# EAGLE design elm104 (EAGLE 4.16)

## Sheet 1 of 3
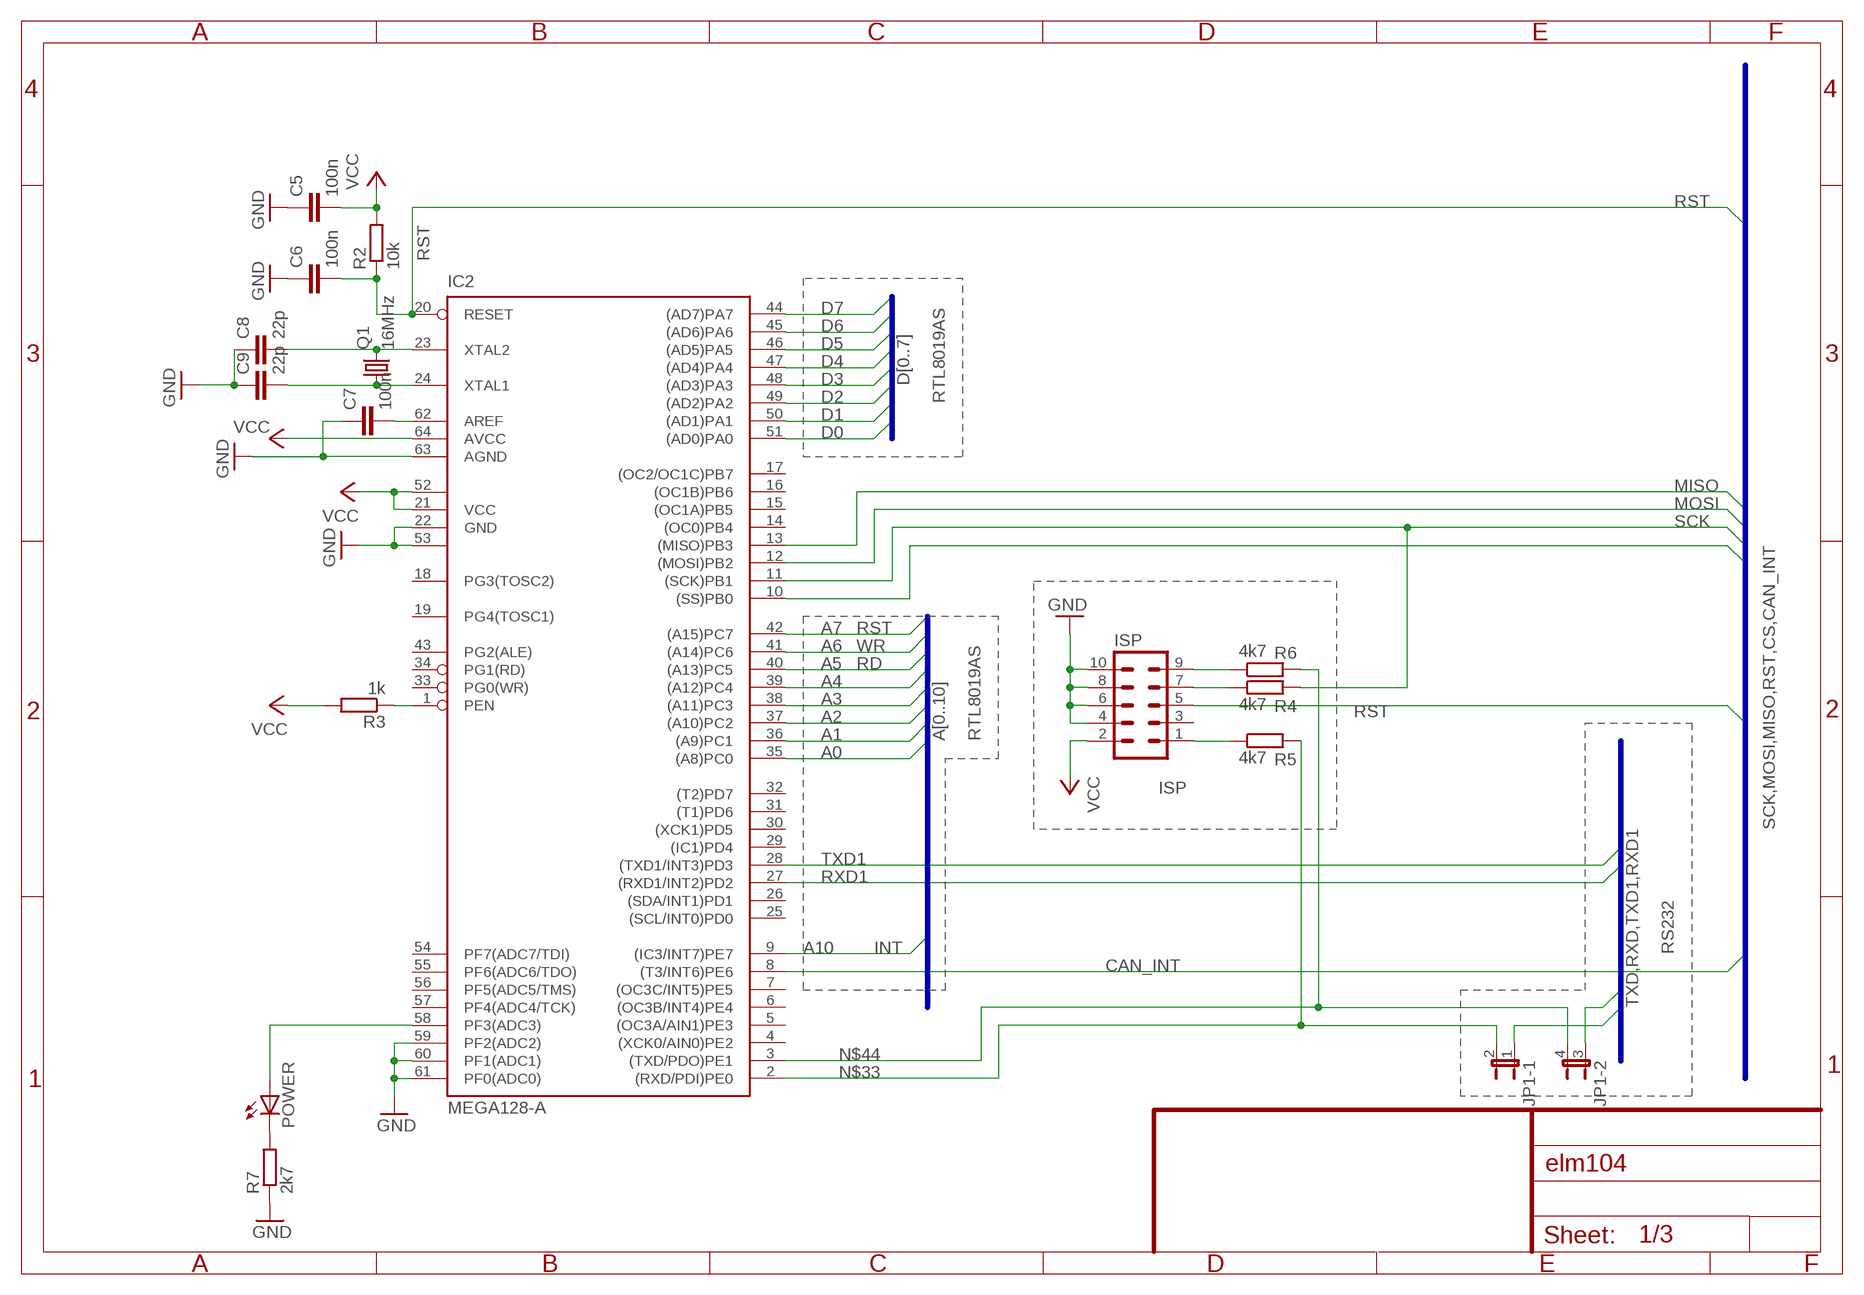
[diagram p0: schematic, sheet 1]

### Parts
C5  100n  C-EUC0603  [C0603]
C6  100n  C-EUC0603  [C0603]
C7  100n  C-EUC0603  [C0603]
C8  22p  C-EUC0603  [C0603]
C9  22p  C-EUC0603  [C0603]
IC2  MEGA128-A  [TQFP64]
ISP  MA05-2  [MA05-2]
JP1  JP2QE  [JP2Q]
POWER  LEDCHIP-LED0805  [CHIP-LED0805]
Q1  16MHz  CRYSTALHC49U-V  [HC49U-V]
R2  10k  R-EU_R0805  [R0805]
R3  1k  R-EU_R0805  [R0805]
R4  4k7  R-EU_R0805  [R0805]
R5  4k7  R-EU_R0805  [R0805]
R6  4k7  R-EU_R0805  [R0805]
R7  2k7  R-EU_R0805  [R0805]

### Nets
A0: IC2.35((A8)PC0) ; also sheet 3
A1: IC2.36((A9)PC1) ; also sheet 3
A2: IC2.37((A10)PC2) ; also sheet 3
A3: IC2.38((A11)PC3) ; also sheet 3
A4: IC2.39((A12)PC4) ; also sheet 3
A5: IC2.40((A13)PC5) ; also sheet 3
A6: IC2.41((A14)PC6) ; also sheet 3
A7: IC2.42((A15)PC7) ; also sheet 3
A10: IC2.9((IC3/INT7)PE7) ; also sheet 3
CAN_INT: IC2.8((T3/INT6)PE6) ; also sheet 2
CS: IC2.10((SS)PB0) ; also sheet 2
D0: IC2.51((AD0)PA0) ; also sheet 3
D1: IC2.50((AD1)PA1) ; also sheet 3
D2: IC2.49((AD2)PA2) ; also sheet 3
D3: IC2.48((AD3)PA3) ; also sheet 3
D4: IC2.47((AD4)PA4) ; also sheet 3
D5: IC2.46((AD5)PA5) ; also sheet 3
D6: IC2.45((AD6)PA6) ; also sheet 3
D7: IC2.44((AD7)PA7) ; also sheet 3
GND: C5.1 C6.1 C7.1 C8.1 C9.1 IC2.22(GND) IC2.53(GND1) IC2.59(PF2(ADC2)) IC2.60(PF1(ADC1)) IC2.61(PF0(ADC0)) IC2.63(AGND) ISP.4 ISP.6 ISP.8 ISP.10 R7.1 ; also sheet 2,3
MISO: IC2.13((MISO)PB3) ; also sheet 2
MOSI: IC2.12((MOSI)PB2) ; also sheet 2
N$5: C7.2 IC2.62(AREF)
N$6: C9.2 IC2.24(XTAL1) Q1.1
N$7: C8.2 IC2.23(XTAL2) Q1.2
N$9: POWER.C R7.2
N$22: ISP.9 R6.1
N$25: ISP.1 R5.1
N$26: IC2.1(PEN) R3.1
N$29: ISP.7 R4.1
N$32: IC2.58(PF3(ADC3)) POWER.A
N$33: IC2.2((RXD/PDI)PE0) JP1.2 R5.2
N$44: IC2.3((TXD/PDO)PE1) JP1.4 R6.2
RST: C6.2 IC2.20(RESET) ISP.5 R2.1 ; also sheet 2
RXD: JP1.1 ; also sheet 2
RXD1: IC2.27((RXD1/INT2)PD2) ; also sheet 2
SCK: IC2.11((SCK)PB1) R4.2 ; also sheet 2
TXD: JP1.3 ; also sheet 2
TXD1: IC2.28((TXD1/INT3)PD3) ; also sheet 2
VCC: C5.2 IC2.21(VCC) IC2.52(VCC1) IC2.64(AVCC) ISP.2 R2.2 R3.2 ; also sheet 2,3
Unconnected: IC2.4((XCK0/AIN0)PE2) IC2.5((OC3A/AIN1)PE3) IC2.6((OC3B/INT4)PE4) IC2.7((OC3C/INT5)PE5) IC2.14((OC0)PB4) IC2.15((OC1A)PB5) IC2.16((OC1B)PB6) IC2.17((OC2/OC1C)PB7) IC2.18(PG3(TOSC2)) IC2.19(PG4(TOSC1)) IC2.25((SCL/INT0)PD0) IC2.26((SDA/INT1)PD1) IC2.29((IC1)PD4) IC2.30((XCK1)PD5) IC2.31((T1)PD6) IC2.32((T2)PD7) IC2.33(PG0(WR)) IC2.34(PG1(RD)) IC2.43(PG2(ALE)) IC2.54(PF7(ADC7/TDI)) IC2.55(PF6(ADC6/TDO)) IC2.56(PF5(ADC5/TMS)) IC2.57(PF4(ADC4/TCK)) ISP.3

### Buses
SCK,MOSI,MISO,RST,CS,CAN_INT
TXD,RXD,TXD1,RXD1
D[0..7]
A[0..10]

### Notes on the sheet
- RTL8019AS
- RST
- WR
- RD
- RTL8019AS
- ISP
- INT | RS232

## Sheet 2 of 3
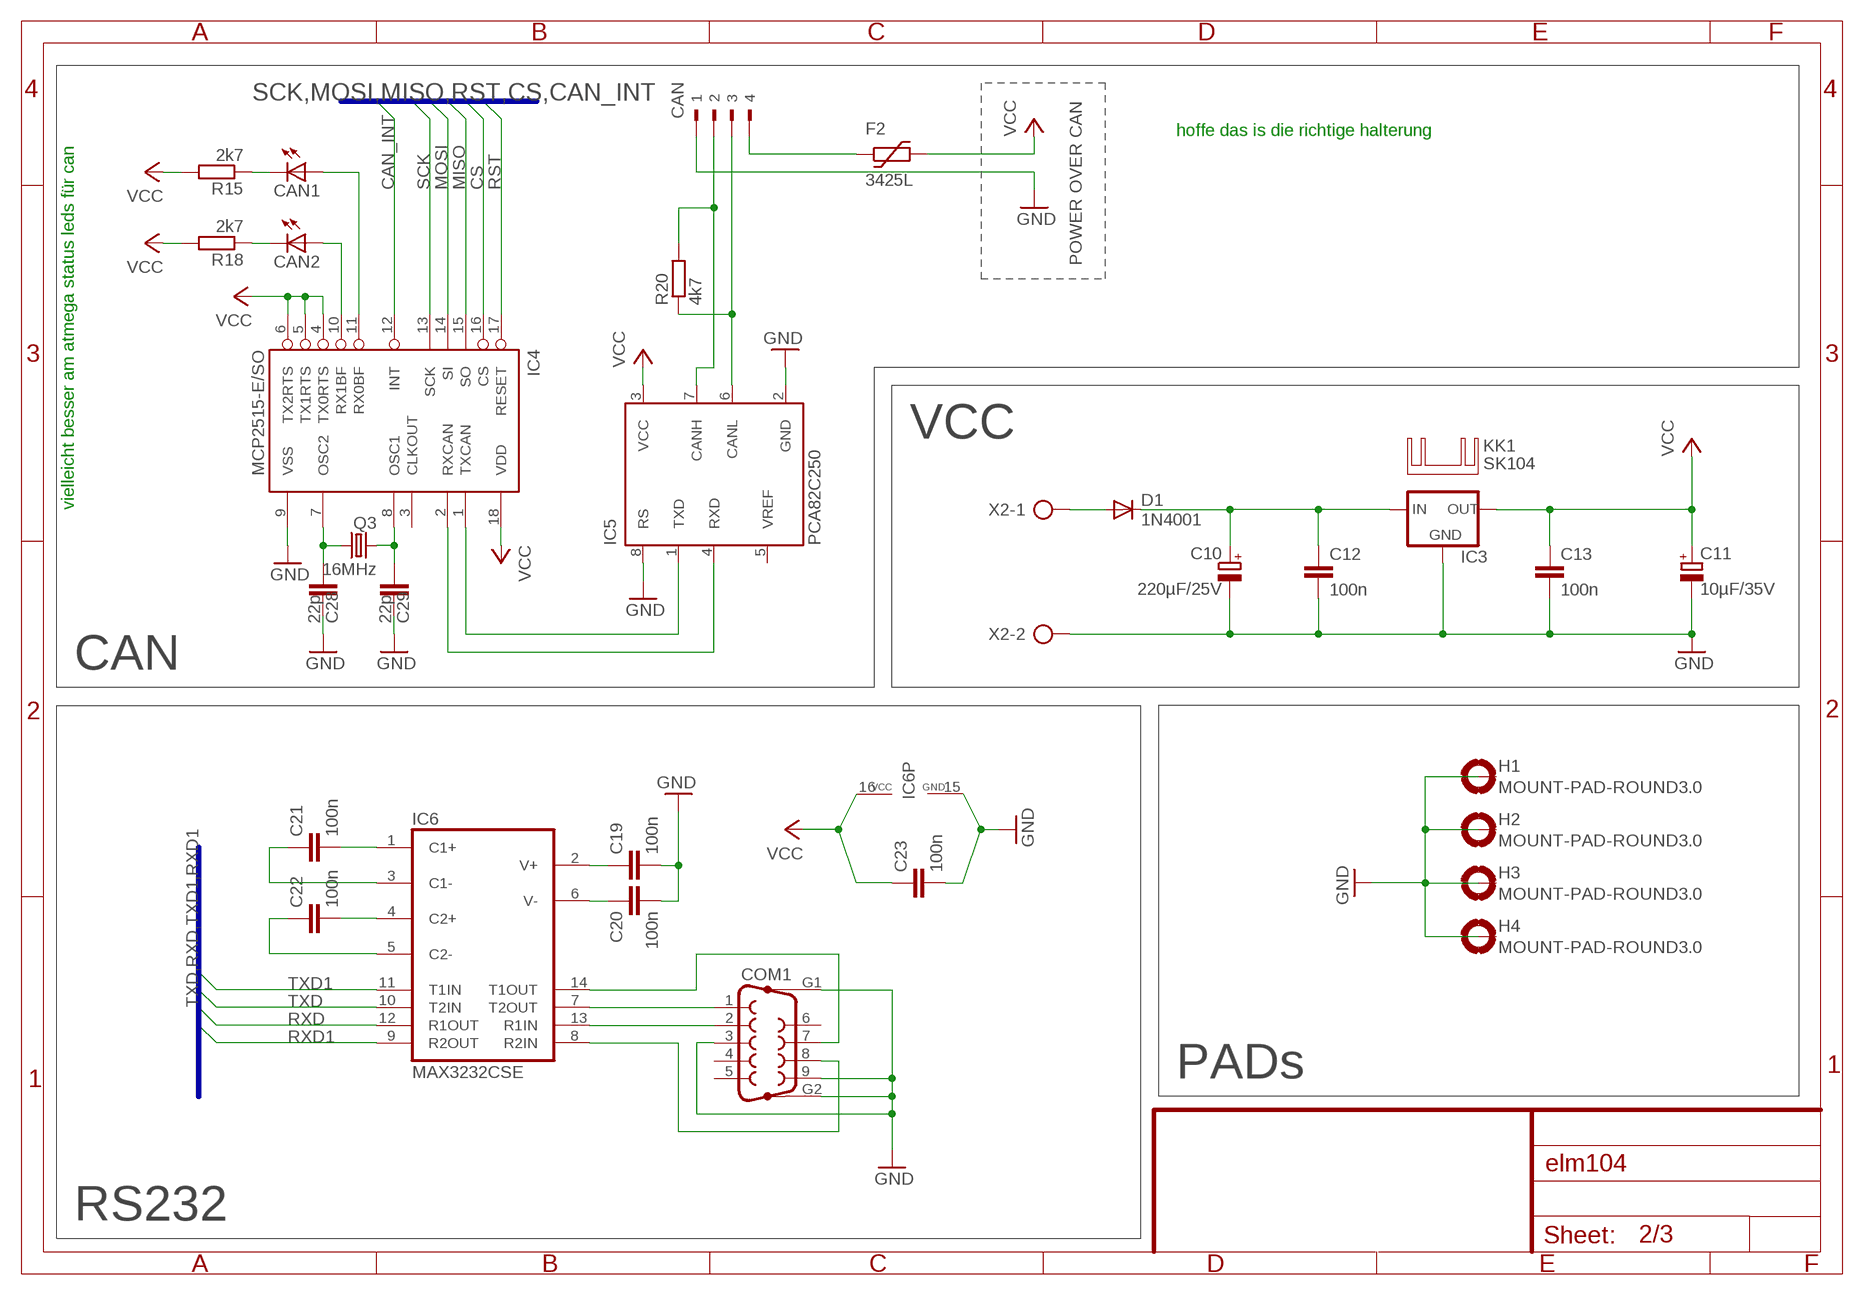
[diagram p1: schematic, sheet 2]

### Parts
C10  220µF/25V  CPOL-EUE3.5-8  [E3,5-8]
C11  10µF/35V  CPOL-EUE2-5  [E2-5]
C12  100n  C-EUC0603  [C0603]
C13  100n  C-EUC0603  [C0603]
C19  100n  C-EUC0603  [C0603]
C20  100n  C-EUC0603  [C0603]
C21  100n  C-EUC0603  [C0603]
C22  100n  C-EUC0603  [C0603]
C23  100n  C-EUC0603  [C0603]
C28  22p  C-EUC0603  [C0603]
C29  22p  C-EUC0603  [C0603]
CAN  90-4  [90-4]
CAN1  LEDCHIP-LED0805  [CHIP-LED0805]
CAN2  LEDCHIP-LED0805  [CHIP-LED0805]
COM1  F09HP  [F09HP]
D1  1N4001  DIODE-DO41-10  [DO41-10]
F2  3425L  [3425L]
H1  MOUNT-PAD-ROUND3.0  [3,0-PAD]
H2  MOUNT-PAD-ROUND3.0  [3,0-PAD]
H3  MOUNT-PAD-ROUND3.0  [3,0-PAD]
H4  MOUNT-PAD-ROUND3.0  [3,0-PAD]
IC3  78XXS  [78XXS]
IC4  MCP2515-E/SO  [SO18L]
IC5  PCA82C250  [DIL08]
IC6  MAX3232CSE  [SO16]
KK1  SK104  [SK104]
Q3  16MHz  CRYSTALHC49U-V  [HC49U-V]
R15  2k7  R-EU_R0805  [R0805]
R18  2k7  R-EU_R0805  [R0805]
R20  4k7  R-EU_R0805  [R0805]
X2  AK500/2-H  [AK500/2-H]

### Nets
CAN_INT: IC4.12(INT) ; also sheet 1
CS: IC4.16(CS) ; also sheet 1
GND: C10.- C11.- C12.2 C13.2 C19.2 C20.2 C23.2 C28.2 C29.2 CAN.1 COM1.3 COM1.9 COM1.G1 COM1.G2 H1.B3,0(MOUNT) H2.B3,0(MOUNT) H3.B3,0(MOUNT) H4.B3,0(MOUNT) IC3.GND IC4.9(VSS) IC5.2(GND) IC5.8(RS) IC6.15(GND) X2.2 ; also sheet 1,3
MISO: IC4.15(SO) ; also sheet 1
MOSI: IC4.14(SI) ; also sheet 1
N$2: IC4.1(TXCAN) IC5.1(TXD)
N$8: C10.+ C12.1 D1.C IC3.IN
N$10: D1.A X2.1
N$16: CAN.4 F2.P$1
N$17: C21.2 IC6.1(C1+)
N$21: IC4.2(RXCAN) IC5.4(RXD)
N$23: CAN.3 IC5.6(CANL) R20.1
N$27: CAN1.A IC4.11(RX0BF)
N$30: C22.2 IC6.4(C2+)
N$36: C22.1 IC6.5(C2-)
N$37: C21.1 IC6.3(C1-)
N$38: CAN2.A IC4.10(RX1BF)
N$40: COM1.7 IC6.14(T1OUT)
N$41: COM1.8 IC6.8(R2IN)
N$43: C19.1 IC6.2(V+)
N$46: C20.1 IC6.6(V-)
N$48: CAN1.C R15.1
N$49: COM1.1 IC6.7(T2OUT)
N$50: COM1.2 IC6.13(R1IN)
N$52: CAN2.C R18.1
N$53: C28.1 IC4.7(OSC2) Q3.1
N$54: C29.1 IC4.8(OSC1) Q3.2
N$59: CAN.2 IC5.7(CANH) R20.2
RST: IC4.17(RESET) ; also sheet 1
RXD: IC6.12(R1OUT) ; also sheet 1
RXD1: IC6.9(R2OUT) ; also sheet 1
SCK: IC4.13(SCK) ; also sheet 1
TXD: IC6.10(T2IN) ; also sheet 1
TXD1: IC6.11(T1IN) ; also sheet 1
VCC: C11.+ C13.1 C23.1 F2.P$2 IC3.OUT IC4.4(TX0RTS) IC4.5(TX1RTS) IC4.6(TX2RTS) IC4.18(VDD) IC5.3(VCC) IC6.16(VCC) R15.2 R18.2 ; also sheet 1,3
Unconnected: COM1.4 COM1.5 COM1.6 IC4.3(CLKOUT) IC5.5(VREF)

### Buses
SCK,MOSI,MISO,RST,CS,CAN_INT
TXD,RXD,TXD1,RXD1

### Notes on the sheet
- POWER OVER CAN
- hoffe das is die richtige halterung
- VCC
- vielleicht besser am atmega status leds für can
- CAN
- PADs
- RS232

## Sheet 3 of 3
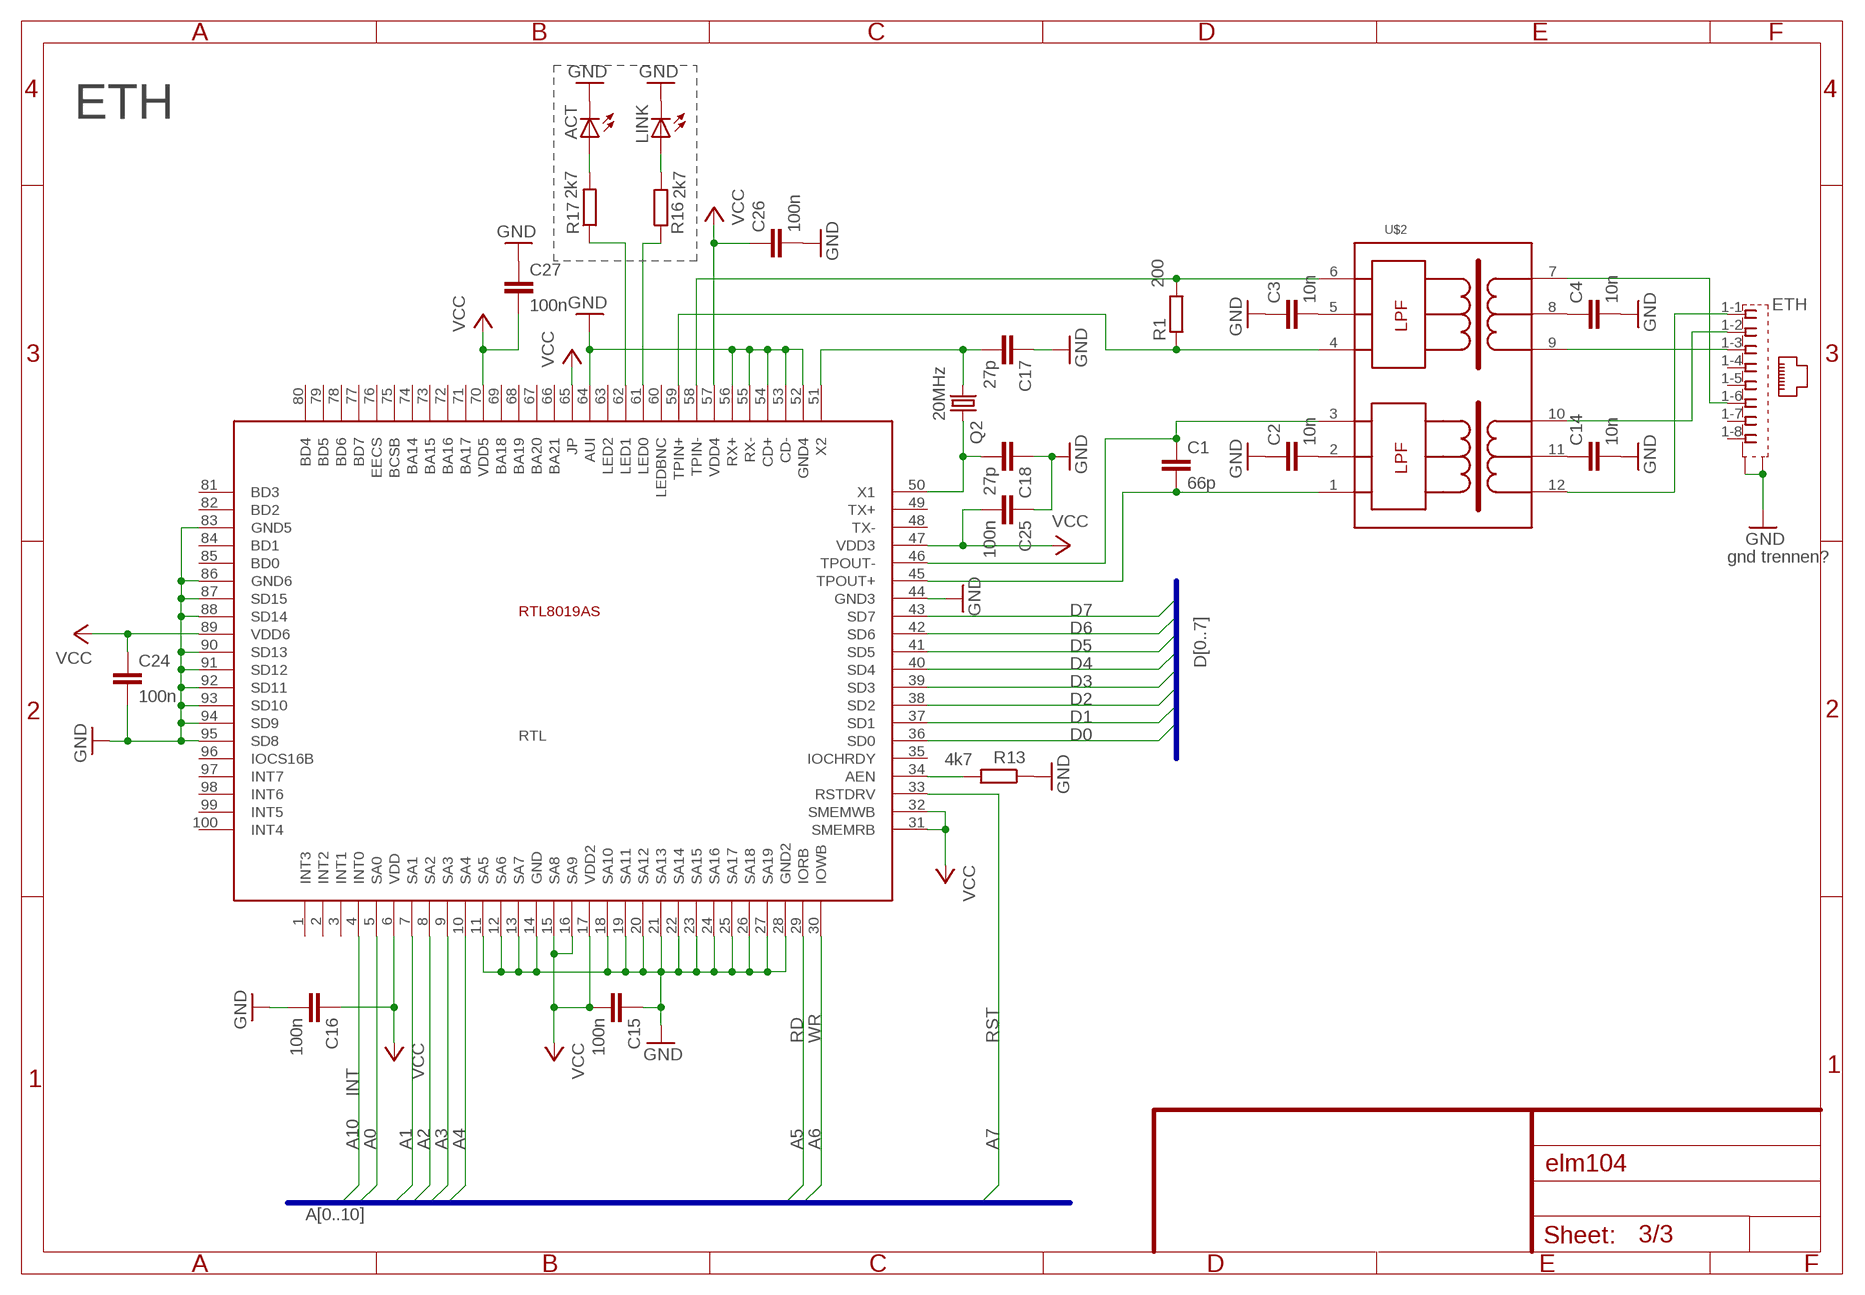
[diagram p2: schematic, sheet 3]

### Parts
ACT  LEDCHIP-LED0805  [CHIP-LED0805]
C1  66p  C-EUC0603  [C0603]
C2  10n  C-EUC0603  [C0603]
C3  10n  C-EUC0603  [C0603]
C4  10n  C-EUC0603  [C0603]
C14  10n  C-EUC0603  [C0603]
C15  100n  C-EUC0603  [C0603]
C16  100n  C-EUC0603  [C0603]
C17  27p  C-EUC0603  [C0603]
C18  27p  C-EUC0603  [C0603]
C24  100n  C-EUC0603  [C0603]
C25  100n  C-EUC0603  [C0603]
C26  100n  C-EUC0603  [C0603]
C27  100n  C-EUC0603  [C0603]
ETH  557786-1  [557786-1]
LINK  LEDCHIP-LED0805  [CHIP-LED0805]
Q2  20MHz  CRYSTALHC49U-V  [HC49U-V]
R1  200  R-EU_R0805  [R0805]
R13  4k7  R-EU_R0805  [R0805]
R16  2k7  R-EU_R0805  [R0805]
R17  2k7  R-EU_R0805  [R0805]
RTL  RTL8019AS  [RTL8019AS]
U$2  20F001  [DIL16/12]

### Nets
A0: RTL.5(SA0) ; also sheet 1
A1: RTL.7(SA1) ; also sheet 1
A2: RTL.8(SA2) ; also sheet 1
A3: RTL.9(SA3) ; also sheet 1
A4: RTL.10(SA4) ; also sheet 1
A5: RTL.29(IORB) ; also sheet 1
A6: RTL.30(IOWB) ; also sheet 1
A7: RTL.33(RSTDRV) ; also sheet 1
A10: RTL.4(INT0) ; also sheet 1
D0: RTL.36(SD0) ; also sheet 1
D1: RTL.37(SD1) ; also sheet 1
D2: RTL.38(SD2) ; also sheet 1
D3: RTL.39(SD3) ; also sheet 1
D4: RTL.40(SD4) ; also sheet 1
D5: RTL.41(SD5) ; also sheet 1
D6: RTL.42(SD6) ; also sheet 1
D7: RTL.43(SD7) ; also sheet 1
GND: ACT.C C2.1 C3.1 C4.2 C14.2 C15.1 C16.2 C17.1 C18.1 C24.2 C25.1 C26.2 C27.1 ETH.G1(S2) ETH.G2(S1) LINK.C R13.1 RTL.11(SA5) RTL.12(SA6) RTL.13(SA7) RTL.14(GND) RTL.18(SA10) RTL.19(SA11) RTL.20(SA12) RTL.21(SA13) RTL.22(SA14) RTL.23(SA15) RTL.24(SA16) RTL.25(SA17) RTL.26(SA18) RTL.27(SA19) RTL.28(GND2) RTL.44(GND3) RTL.52(GND4) RTL.53(CD-) RTL.54(CD+) RTL.55(RX-) RTL.56(RX+) RTL.64(AUI) RTL.83(GND5) RTL.86(GND6) RTL.87(SD15) RTL.88(SD14) RTL.90(SD13) RTL.91(SD12) RTL.92(SD11) RTL.93(SD10) RTL.94(SD9) RTL.95(SD8) ; also sheet 1,2
N$1: R1.2 RTL.58(TPIN-) U$2.6
N$3: R1.1 RTL.59(TPIN+) U$2.4
N$4: C1.1 RTL.46(TPOUT-) U$2.3
N$11: C1.2 RTL.45(TPOUT+) U$2.1
N$12: C3.2 U$2.5
N$13: C2.2 U$2.2
N$14: C14.1 U$2.11
N$15: C4.1 U$2.8
N$18: ETH.1-1 U$2.12
N$19: ETH.1-2 U$2.10
N$20: ETH.1-3 U$2.9
N$24: ETH.1-6 U$2.7
N$28: ACT.A R17.2
N$31: LINK.A R16.2
N$34: C17.2 Q2.2 RTL.51(X2)
N$35: C18.2 Q2.1 RTL.50(X1)
N$39: R13.2 RTL.34(AEN)
N$45: R16.1 RTL.61(LED0)
N$47: R17.1 RTL.62(LED1)
VCC: C15.2 C16.1 C24.1 C25.2 C26.1 C27.2 RTL.6(VDD) RTL.15(SA8) RTL.16(SA9) RTL.17(VDD2) RTL.31(SMEMRB) RTL.32(SMEMWB) RTL.47(VDD3) RTL.57(VDD4) RTL.65(JP) RTL.70(VDD5) RTL.89(VDD6) ; also sheet 1,2
Unconnected: ETH.1-4 ETH.1-5 ETH.1-7 ETH.1-8 RTL.1(INT3) RTL.2(INT2) RTL.3(INT1) RTL.35(IOCHRDY) RTL.48(TX-) RTL.49(TX+) RTL.60(LEDBNC) RTL.63(LED2) RTL.66(BA21) RTL.67(BA20) RTL.68(BA19) RTL.69(BA18) RTL.71(BA17) RTL.72(BA16) RTL.73(BA15) RTL.74(BA14) RTL.75(BCSB) RTL.76(EECS) RTL.77(BD7) RTL.78(BD6) RTL.79(BD5) RTL.80(BD4) RTL.81(BD3) RTL.82(BD2) RTL.84(BD1) RTL.85(BD0) RTL.96(IOCS16B) RTL.97(INT7) RTL.98(INT6) RTL.99(INT5) RTL.100(INT4)

### Buses
D[0..7]
A[0..10]

### Notes on the sheet
- ETH
- gnd trennen?
- RD | WR | RST
- INT

## Library data of the parts
ACT CAN1 CAN2 LINK POWER = led:LED: LED OSRAM: - CHIPLED LG R971, LG N971, LY N971, LG Q971, LY Q971, LO R971, LY R971 LH N974, LH R974 LS Q976, LO Q976, LY Q976 LO Q996 - Hyper CHIPLED LW Q18S LB Q993, LB Q99A, LB R99A - SideLED LS A670, LO A670, LY A670, LG A670, LP A670 LB A673, LV A673, LT A673, LW A673 LH A674 LY A675 LS A676, LA A676, LO A676, LY A676, LW A676 LS A679, LY A679, LG A679 - Hyper Micro SIDELED® LS Y876, LA Y876, LO Y876, LY Y876 LT Y87S - SmartLED LW L88C, LW L88S LB L89C, LB L89S, LG L890 LS L89K, LO L89K, LY L89K LS L896, LA L896, LO L896, LY L896 - TOPLED LS T670, LO T670, LY T670, LG T670, LP T670 LSG T670, LSP T670, LSY T670, LOP T670, LYG T670 LG T671, LOG T671, LSG T671 LB T673, LV T673, LT T673, LW T673 LH T674 LS T676, LA T676, LO T676, LY T676, LB T676, LH T676, LSB T676, LW T676 LB T67C, LV T67C, LT T67C, LS T67K, LO T67K, LY T67K, LW E67C LS E67B, LA E67B, LO E67B, LY E67B, LB E67C, LV E67C, LT E67C LW T67C LS T679, LY T679, LG T679 LS T770, LO T770, LY T770, LG T770, LP T770 LB T773, LV T773, LT T773, LW T773 LH T774 LS E675, LA E675, LY E675, LS T675 LS T776, LA T776, LO T776, LY T776, LB T776 LHGB T686 LT T68C, LB T68C - Hyper Mini TOPLED® LB M676 - Mini TOPLED Santana® LG M470 LS M47K, LO M47K, LY M47K Source: http://www.osram.convergy.de - LUMILED® LXK2-PW12-R00, LXK2-PW12-S00, LXK2-PW14-U00, LXK2-PW14-V00 LXK2-PM12-R00, LXK2-PM12-S00, LXK2-PM14-U00 LXK2-PE12-Q00, LXK2-PE12-R00, LXK2-PE12-S00, LXK2-PE14-T00, LXK2-PE14-U00 LXK2-PB12-K00, LXK2-PB12-L00, LXK2-PB12-M00, LXK2-PB14-N00, LXK2-PB14-P00, LXK2-PB14-Q00 LXK2-PR12-L00, LXK2-PR12-M00, LXK2-PR14-Q00, LXK2-PR14-R00 LXK2-PD12-Q00, LXK2-PD12-R00, LXK2-PD12-S00 LXK2-PH12-R00, LXK2-PH12-S00 LXK2-PL12-P00, LXK2-PL12-Q00, LXK2-PL12-R00 Source: www.luxeon.com
C1-C9 C12-C29 = rcl:C-EU: CAPACITOR, European symbol
C10 C11 = rcl:CPOL-EU: POLARIZED CAPACITOR, European symbol
CAN = con-weidmueller-sl35:90-4: WEIDMUELLER CLAMP CONNECTOR
COM1 = con-subd:F09HP: SUB-D
D1 = diode:DIODE-: DIODE
ETH = con-amp:557786-1: AMP connector
F2 = ptc-littlefuse:3425L
H1-H4 = holes:MOUNT-PAD-ROUND: MOUNTING PAD, round
IC2 = atmel:MEGA128: MICROCONTROLLER 128 Kbytes FLASH 4 Kbytes SRAM 4 Kbytes EEPROM DUAL USART 8-channel 10 bit ADC Source: avr.lbr
IC3 = v-reg:78XXS: VOLTAGE REGULATOR
IC4 = mcp2515:MCP2515
IC5 = micro-philips:PCA82C250: CAN CONTROLLER INTERFACE
IC6 = maxim:MAX3232*: True RS-232 Transceivers 3.0V to 5.5V, Low-Power up to 1Mbps, Using Four 0.1µF External Capacitors Source: http://pdfserv.maxim-ic.com/en/ds/MAX3222-MAX3241.pdf
ISP = con-lstb:MA05-2: PIN HEADER
JP1 = jumper:JP2QE: JUMPER
KK1 = heatsink:SK104: HEATSINK manufacturer Fischer/distributor Buerklin
Q1-Q3 = crystal:CRYSTAL: CRYSTAL
R1-R7 R13 R15-R18 R20 = rcl:R-EU_: RESISTOR, European symbol
RTL = rtl8019as:RTL8019AS
U$2 = Realtek:20F001
X2 = con-ptr500:AK500/2-H: CONNECTOR Aug. 2004 / PTR Meßtechnik: Die Bezeichnung der Serie AK505 wurde geändert. Es handelt sich hierbei um AK500 in horizontaler Ausführung.

## Board
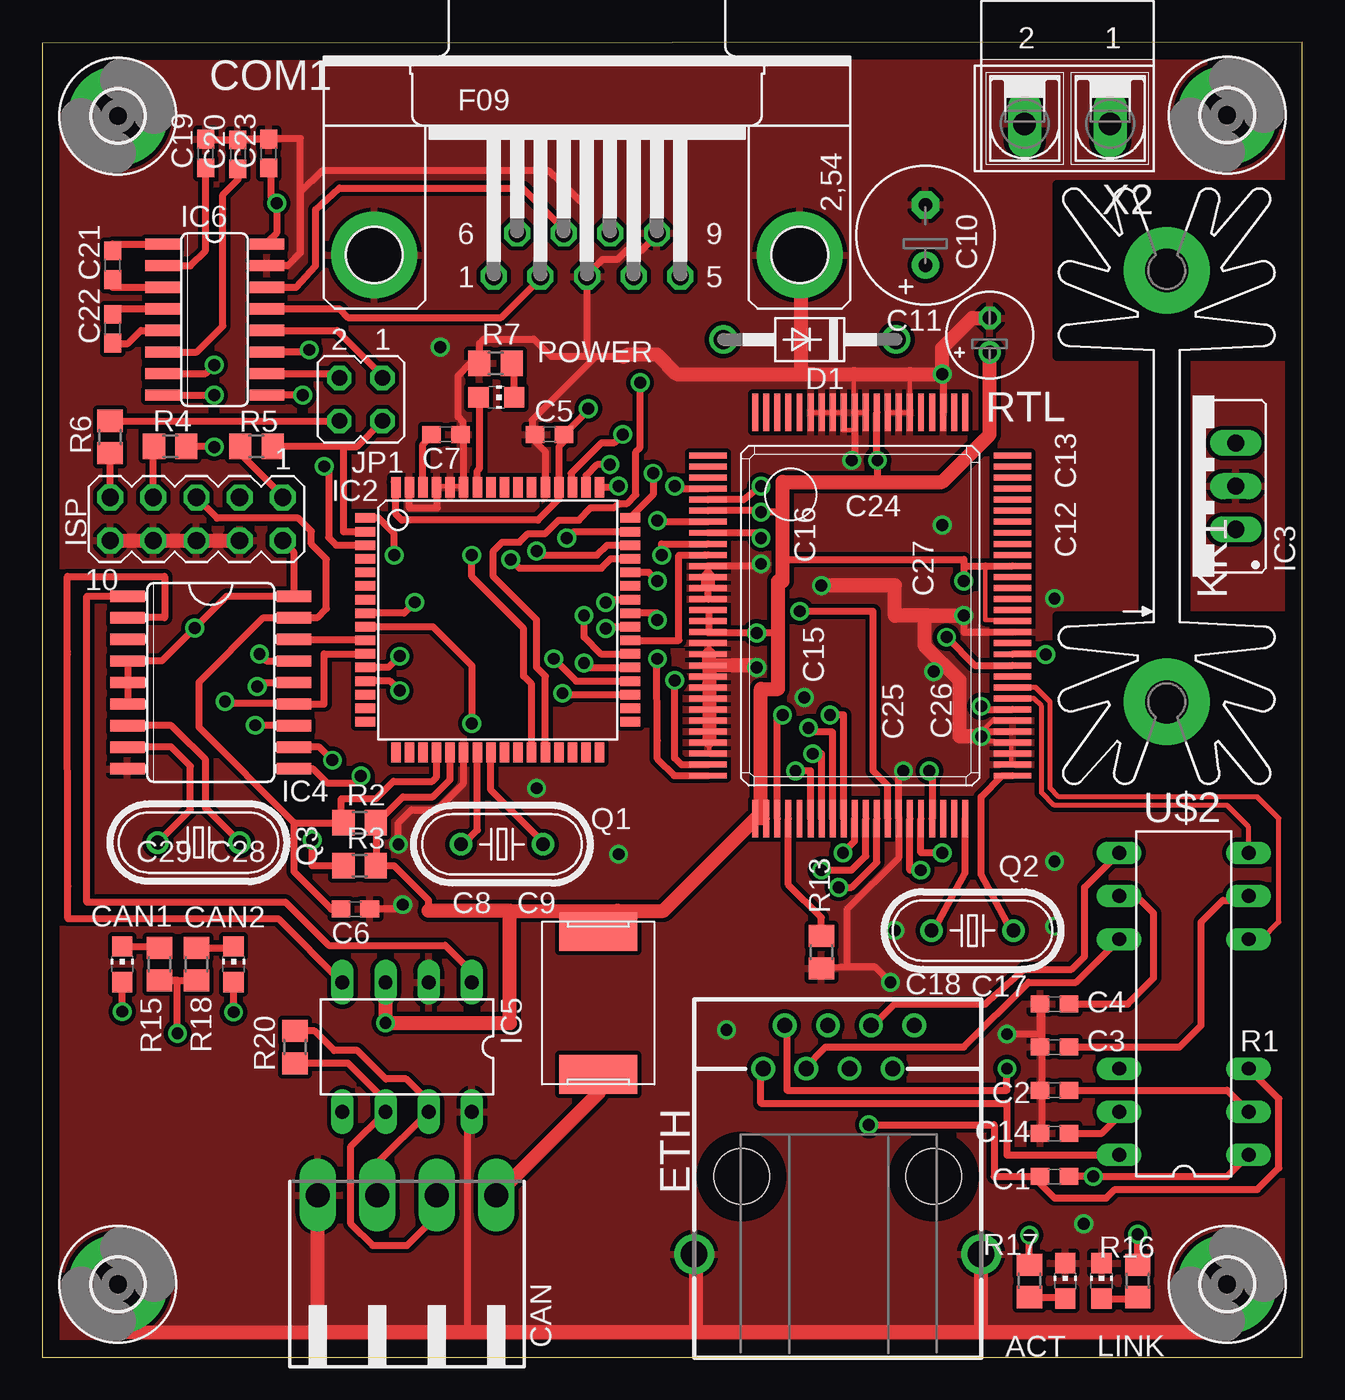
[diagram p3: board, top side]
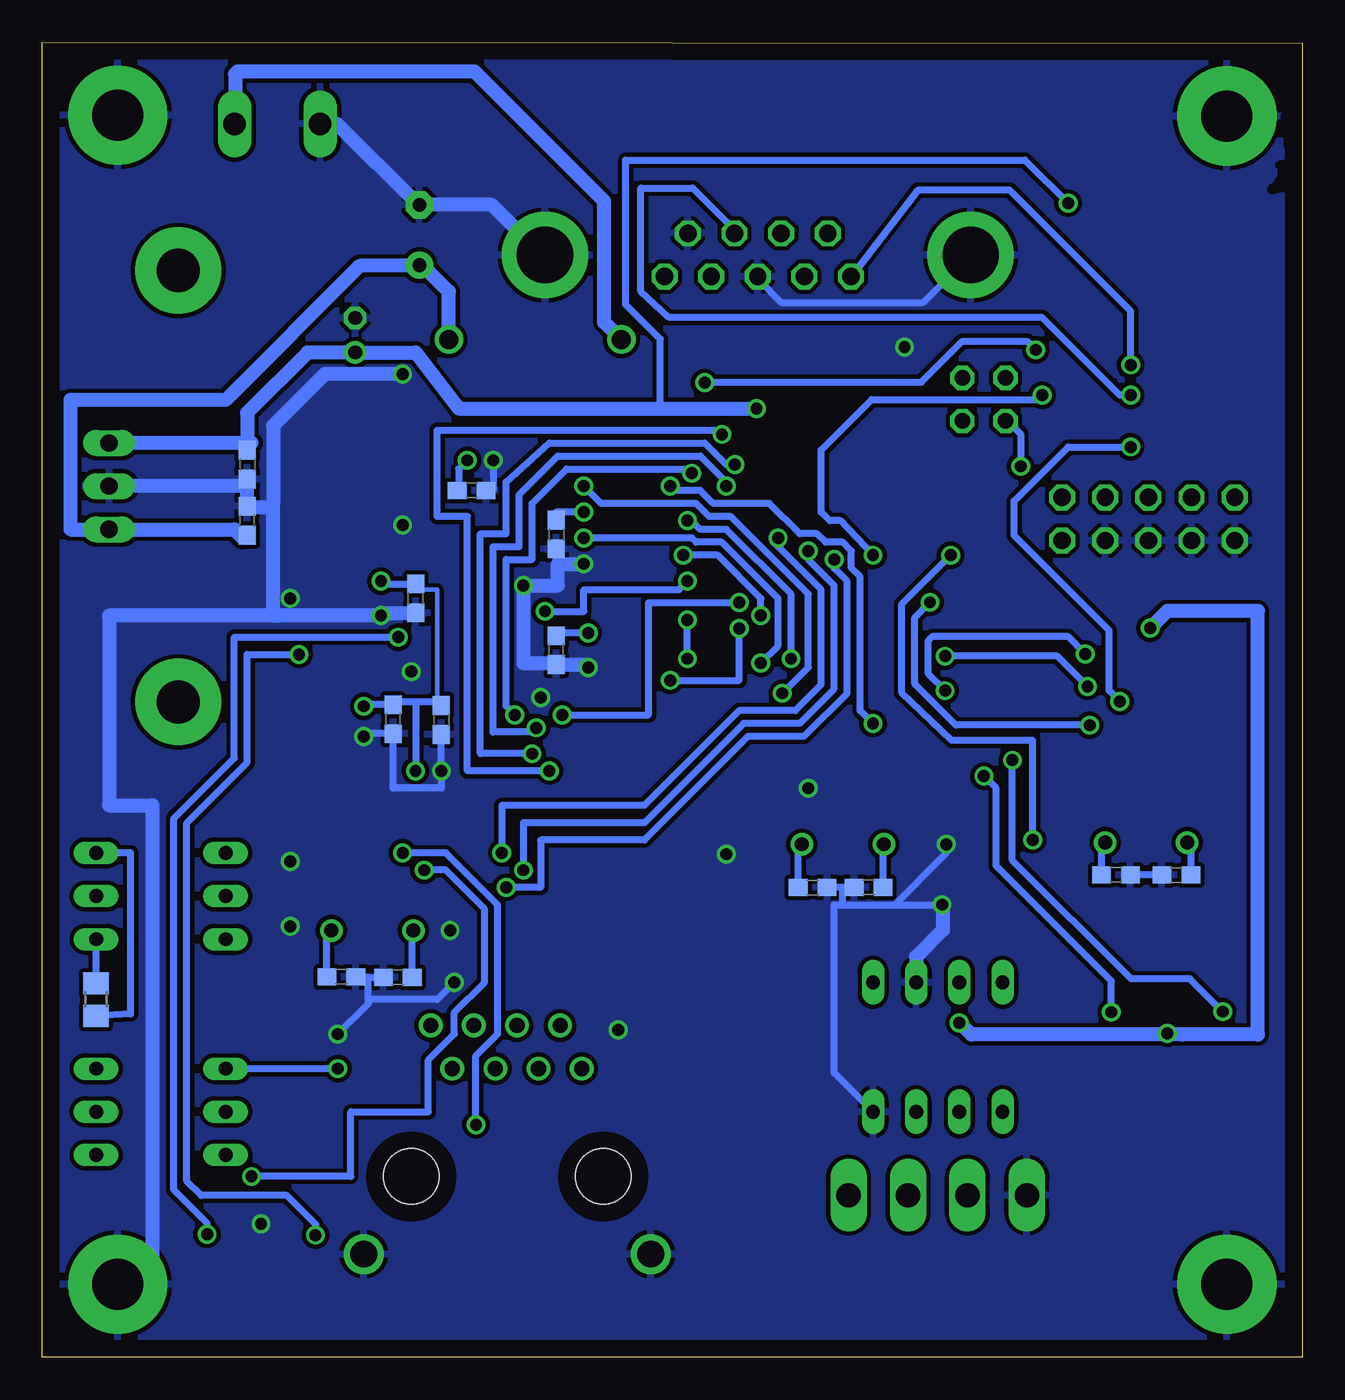
[diagram p4: board, bottom side, seen from below]

Size 74.15 x 77.39 mm. Coordinates in mm from the lower left corner, seen from the top.
Outline: 0,0 74.15,0 74.15,77.39 0,77.34 0,0
Copper layers (1*16): Top 0.035mm / dielectric 1.5mm / Bottom 0.035mm
Design rules "olimex_8mils": minimum track width 10mil, minimum drill 24mil, track to track 8mil, track to pad 8mil, pad to pad 8mil, via to via 8mil, smd to smd 8mil, copper to edge 40mil, drill to drill 10mil, minimum pad ring 10mil, minimum via ring 8mil, stop-mask expansion 0mil, vias tented up to drill 0mil, thermal gap 10mil
tRestrict: area -14,72.3 to -14,72.4; area -14,72.3 to -14,72.4; area -14,72.3 to -14,72.4; area -14,72.3 to -13.9,72.4; area -13.9,72.4 to -13.9,72.5; area -13.9,72.3 to -13.9,72.3; area -13.9,72.4 to -13.9,72.5; area -13.9,72.3 to -13.9,72.3; area -13.9,72.4 to -13.9,72.5; area -13.9,72.3 to -13.9,72.3; area -13.9,72.4 to -13.8,72.5; area -13.9,72.3 to -13.8,72.3; 797 more areas
bRestrict: area -2.4,74.2 to -2.4,74.3; area -2.4,74.2 to -2.3,74.3; area -2.3,74.2 to -2.3,74.3; area -2.3,74.2 to -2.3,74.4; area -2.3,74.3 to -2.3,74.4; area -2.3,74.2 to -2.3,74.3; area -2.3,74.3 to -2.2,74.4; area -2.3,74.2 to -2.2,74.3; area -2.2,74.3 to -2.2,74.4; area -2.2,74.2 to -2.2,74.3; area -2.2,74.4 to -2.2,74.5; area -2.2,74.2 to -2.2,74.2; 797 more areas

### Footprints (pad centres in the part's own frame; a part is rotated, then mirrored left to right if it is on the bottom)
CHIP-LED0805 = smd 1.2 x 1.2: A 0,-1.05; C 0,1.05
C0603 = smd 1.1 x 1: 1 -0.85,0; 2 0.85,0
E3,5-8 = drill 0.813 pad 1.6 round: + -1.778,0 | drill 0.813 pad 1.6 octagon: - 1.778,0
E2-5 = drill 0.813 pad 1.27 round: + -1.016,0 | drill 0.813 pad 1.27 octagon: - 1.016,0
90-4 = drill 1.422 long: 1 -5.25,5.25; 2 -1.75,5.25; 3 1.75,5.25; 4 5.25,5.25
F09HP = drill 1.016 octagon: 1 -5.486,-1.27; 2 -2.743,-1.27; 3 0,-1.27; 4 2.743,-1.27; 5 5.486,-1.27; 6 -4.115,1.27; 7 -1.372,1.27; 8 1.372,1.27; 9 4.115,1.27 | drill 3.302 pad 5.08 round: G1 -12.522,0; G2 12.522,0
DO41-10 = drill 1.118 round: A 5.08,0; C -5.08,0
557786-1 = drill 0.889 round: 1-1 -4.445,6.35; 1-2 -3.175,8.89; 1-3 -1.905,6.35; 1-4 -0.635,8.89; 1-5 0.635,6.35; 1-6 1.905,8.89; 1-7 3.175,6.35; 1-8 4.445,8.89 | drill 1.575 pad 2.184 round: G1 -8.509,-4.572; G2 8.382,-4.572 | hole 3.251: -5.715,0; 5.588,0
3425L = smd 2.29 x 4.57: P$1 -4.2,0; P$2 4.2,0
3,0-PAD = drill 3 pad 5.842 round: B3,0 0,0
TQFP64 = smd 1.194 x 0.559: 1 -7.8,6; 2 -7.8,5.2; 3 -7.8,4.4; 4 -7.8,3.6; 5 -7.8,2.8; 6 -7.8,2; 7 -7.8,1.2; 8 -7.8,0.4; 9 -7.8,-0.4; 10 -7.8,-1.2; 11 -7.8,-2; 12 -7.8,-2.8; 13 -7.8,-3.6; 14 -7.8,-4.4; 15 -7.8,-5.2; 16 -7.8,-6; 33 7.8,-6; 34 7.8,-5.2; 35 7.8,-4.4; 36 7.8,-3.6; 37 7.8,-2.8; 38 7.8,-2; 39 7.8,-1.2; 40 7.8,-0.4; 41 7.8,0.4; 42 7.8,1.2; 43 7.8,2; 44 7.8,2.8; 45 7.8,3.6; 46 7.8,4.4; 47 7.8,5.2; 48 7.8,6 | smd 0.559 x 1.194: 17 -6,-7.8; 18 -5.2,-7.8; 19 -4.4,-7.8; 20 -3.6,-7.8; 21 -2.8,-7.8; 22 -2,-7.8; 23 -1.2,-7.8; 24 -0.4,-7.8; 25 0.4,-7.8; 26 1.2,-7.8; 27 2,-7.8; 28 2.8,-7.8; 29 3.6,-7.8; 30 4.4,-7.8; 31 5.2,-7.8; 32 6,-7.8; 49 6,7.8; 50 5.2,7.8; 51 4.4,7.8; 52 3.6,7.8; 53 2.8,7.8; 54 2,7.8; 55 1.2,7.8; 56 0.4,7.8; 57 -0.4,7.8; 58 -1.2,7.8; 59 -2,7.8; 60 -2.8,7.8; 61 -3.6,7.8; 62 -4.4,7.8; 63 -5.2,7.8; 64 -6,7.8
78XXS = drill 1.016 long: GND 0,-2.54; IN -2.54,-2.54; OUT 2.54,-2.54
SO18L = smd 0.66 x 2.032: 1 -5.08,-4.902; 2 -3.81,-4.902; 3 -2.54,-4.902; 4 -1.27,-4.902; 5 0,-4.902; 6 1.27,-4.902; 7 2.54,-4.902; 8 3.81,-4.902; 9 5.08,-4.902; 10 5.08,4.902; 11 3.81,4.902; 12 2.54,4.902; 13 1.27,4.902; 14 0,4.902; 15 -1.27,4.902; 16 -2.54,4.902; 17 -3.81,4.902; 18 -5.08,4.902
DIL08 = drill 0.813 long: 1 -3.81,-3.81; 2 -1.27,-3.81; 3 1.27,-3.81; 4 3.81,-3.81; 5 3.81,3.81; 6 1.27,3.81; 7 -1.27,3.81; 8 -3.81,3.81
SO16 = smd 0.66 x 2.032: 1 -4.445,-3.073; 2 -3.175,-3.073; 3 -1.905,-3.073; 4 -0.635,-3.073; 5 0.635,-3.073; 6 1.905,-3.073; 7 3.175,-3.073; 8 4.445,-3.073; 9 4.445,3.073; 10 3.175,3.073; 11 1.905,3.073; 12 0.635,3.073; 13 -0.635,3.073; 14 -1.905,3.073; 15 -3.175,3.073; 16 -4.445,3.073
MA05-2 = drill 1.016 octagon: 1 -5.08,-1.27; 2 -5.08,1.27; 3 -2.54,-1.27; 4 -2.54,1.27; 5 0,-1.27; 6 0,1.27; 7 2.54,-1.27; 8 2.54,1.27; 9 5.08,-1.27; 10 5.08,1.27
JP2Q = drill 0.914 octagon: 1 -1.27,-1.27; 2 -1.27,1.27; 3 1.27,-1.27; 4 1.27,1.27
SK104 = drill 2.54 pad 5.08 round: A2,5 -12.7,-0.762; B2,5 12.7,-0.762
HC49U-V = drill 0.813 round: 1 -2.413,0; 2 2.413,0
R0805 = smd 1.3 x 1.5: 1 -0.95,0; 2 0.95,0
RTL8019AS = smd 0.35 x 2.2: 1 -9.425,-8.965; 2 -8.775,-8.965; 3 -8.125,-8.965; 4 -7.475,-8.965; 5 -6.825,-8.965; 6 -6.175,-8.965; 7 -5.525,-8.965; 8 -4.875,-8.965; 9 -4.225,-8.965; 10 -3.575,-8.965; 11 -2.925,-8.965; 12 -2.275,-8.965; 13 -1.625,-8.965; 14 -0.975,-8.965; 15 -0.325,-8.965; 16 0.325,-8.965; 17 0.975,-8.965; 18 1.625,-8.965; 19 2.275,-8.965; 20 2.925,-8.965; 21 3.575,-8.965; 22 4.225,-8.965; 23 4.875,-8.965; 24 5.525,-8.965; 25 6.175,-8.965; 26 6.825,-8.965; 27 7.475,-8.965; 28 8.125,-8.965; 29 8.775,-8.965; 30 9.425,-8.965; 51 9.425,8.965; 52 8.775,8.965; 53 8.125,8.965; 54 7.475,8.965; 55 6.825,8.965; 56 6.175,8.965; 57 5.525,8.965; 58 4.875,8.965; 59 4.225,8.965; 60 3.575,8.965; 61 2.925,8.965; 62 2.275,8.965; 63 1.625,8.965; 64 0.975,8.965; 65 0.325,8.965; 66 -0.325,8.965; 67 -0.975,8.965; 68 -1.625,8.965; 69 -2.275,8.965; 70 -2.925,8.965; 71 -3.575,8.965; 72 -4.225,8.965; 73 -4.875,8.965; 74 -5.525,8.965; 75 -6.175,8.965; 76 -6.825,8.965; 77 -7.475,8.965; 78 -8.125,8.965; 79 -8.775,8.965; 80 -9.425,8.965 | smd 2.2 x 0.35: 31 11.965,-6.175; 32 11.965,-5.525; 33 11.965,-4.875; 34 11.965,-4.225; 35 11.965,-3.575; 36 11.965,-2.925; 37 11.965,-2.275; 38 11.965,-1.625; 39 11.965,-0.975; 40 11.965,-0.325; 41 11.965,0.325; 42 11.965,0.975; 43 11.965,1.625; 44 11.965,2.275; 45 11.965,2.925; 46 11.965,3.575; 47 11.965,4.225; 48 11.965,4.875; 49 11.965,5.525; 50 11.965,6.175; 81 -11.965,6.175; 82 -11.965,5.525; 83 -11.965,4.875; 84 -11.965,4.225; 85 -11.965,3.575; 86 -11.965,2.925; 87 -11.965,2.275; 88 -11.965,1.625; 89 -11.965,0.975; 90 -11.965,0.325; 91 -11.965,-0.325; 92 -11.965,-0.975; 93 -11.965,-1.625; 94 -11.965,-2.275; 95 -11.965,-2.925; 96 -11.965,-3.575; 97 -11.965,-4.225; 98 -11.965,-4.875; 99 -11.965,-5.525; 100 -11.965,-6.175
DIL16/12 = drill 0.813 long: 1 -8.89,-3.81; 2 -6.35,-3.81; 3 -3.81,-3.81; 4 3.81,-3.81; 5 6.35,-3.81; 6 8.89,-3.81; 7 8.89,3.81; 8 6.35,3.81; 9 3.81,3.81; 10 -3.81,3.81; 11 -6.35,3.81; 12 -8.89,3.81
AK500/2-H = drill 1.321 long: 1 -2.515,0; 2 2.515,0

### Placement (x,y rotation side)
ACT  60.19,4.48 0 top
C1  59.56,10.63 0 top
C2  59.56,15.71 0 top
C3  59.56,18.25 0 top
C4  59.56,20.79 180 top
C5  29.84,54.32 0 top
C6  18.41,26.38 180 top
C7  23.74,54.32 180 top
C8  25.52,27.65 0 bottom
C9  28.82,27.65 180 bottom
C10  51.96,66.05 90 top
C11  55.75,60.16 90 top
C12  62.1,49.24 90 bottom
C13  62.1,52.54 270 bottom
C14  59.56,13.17 180 top
C15  43.91,41.62 90 bottom
C16  43.91,48.43 270 bottom
C17  56.56,22.39 180 bottom
C18  53.23,22.36 0 bottom
C19  9.6,70.85 90 top
C20  11.5,70.8 90 top
C21  4.14,64.27 90 top
C22  4.14,60.54 90 top
C23  13.3,70.85 90 top
C24  48.89,51.02 0 bottom
C25  50.67,37.5 90 bottom
C26  53.51,37.55 270 bottom
C27  52.19,44.67 90 bottom
C28  10.97,28.38 0 bottom
C29  7.41,28.38 180 bottom
CAN  21.46,4.28 0 top
CAN1  4.69,23.13 0 top
CAN2  11.25,23.13 0 top
COM1  32.05,64.88 0 top
D1  45.16,59.91 180 top
ETH  46.86,10.63 0 top
F2  32.71,20.84 90 top
H1  69.72,4.28 0 top
H2  4.44,73.06 0 top
H3  4.44,4.28 0 top
H4  69.72,73.11 0 top
IC2  26.79,43.4 0 top
IC3  67.69,51.27 90 top
IC4  9.9,39.71 270 top
IC5  21.46,18.25 180 top
IC6  10.13,61.07 270 top
ISP  9.06,49.34 180 top
JP1  18.74,56.38 180 top
KK1  65.4,51.27 90 top
LINK  62.33,4.48 0 top
POWER  26.72,56.5 270 top
Q1  27.05,30.19 180 top
Q2  54.73,25.11 0 top
Q3  9.19,30.29 180 top
R1  70.99,21.04 270 bottom
R2  18.66,31.46 0 top
R3  18.66,28.92 0 top
R4  7.51,53.61 0 top
R5  12.59,53.61 0 top
R6  3.98,54.17 90 top
R7  26.66,58.51 0 top
R13  45.84,23.84 90 top
R15  6.88,23.13 270 top
R16  64.46,4.48 270 top
R17  58.08,4.48 270 top
R18  9.06,23.13 270 top
R20  14.85,18.25 90 top
RTL  48.13,43.65 270 top
U$2  67.18,20.79 90 top
X2  60.32,72.61 180 top

### Tracks (layer width: path | path; a pad name or v marks a point on that pad's centre or on a via)
A0  (via drill 0.7)
  Top 0.406: RTL.5 41.27,50.48 v42.29,51.27 | IC2.35 30.6,39 v30.6,39.08
  Bottom 0.406: v30.6,39.08 29.08,40.6 29.08,44.92 33.65,49.49 34.92,49.49 35.68,50.25 41.27,50.25 v42.29,51.27
A1  (via drill 0.7)
  Top 0.406: RTL.7 36.44,49.18 v36.19,49.24 | IC2.36 31.41,39.8 v30.09,41.11
  Bottom 0.406: v30.09,41.11 30.09,44.92 33.9,48.73 35.43,48.73 35.94,49.24 v36.19,49.24
A2  (via drill 0.7)
  Top 0.406: RTL.8 41.98,48.53 v42.29,48.22 | IC2.37 32.13,40.6 v31.87,40.86
  Bottom 0.406: v31.87,40.86 30.86,41.87 30.86,44.67 34.16,47.97 35.68,47.97 35.94,48.22 v42.29,48.22
A3  (via drill 0.7)
  Top 0.406: 32.86,41.4 IC2.38 | v31.87,43.65 31.87,42.38 32.86,41.4 | 32.89,41.36 32.86,41.4 | RTL.9 36.44,47.88 v36.44,47.21
  Bottom 0.406: v31.87,43.65 31.87,44.67 34.41,47.21 v36.44,47.21
A4
  Top 0.406: IC2.39 37.46,42.2 37.46,47.21 38.98,47.21 38.98,47.23 RTL.10
A5  (via drill 0.7)
  Top 0.406: IC2.40 33.14,43 v33.14,42.89 | RTL.29 37.6,34.88 37.21,35.27 v37.21,39.84
  Bottom 0.406: v33.14,42.89 33.14,39.84 v37.21,39.84
A6  (via drill 0.7)
  Top 0.406: IC2.41 36.19,43.8 v36.19,43.4 | RTL.30 37.18,34.23 36.19,35.21 36.19,36.28 36.16,41.08 v36.19,41.11
  Bottom 0.406: v36.19,41.11 v36.19,43.4
A7  (via drill 0.7)
  Top 0.406: IC2.42 33.14,44.6 v33.14,44.41 | RTL.33 43.25,37.76 v43.56,37.81
  Bottom 0.406: v43.56,37.81 38.48,37.81 38.48,44.41 v33.14,44.41
A10  (via drill 0.7)
  Top 0.406: IC2.9 22.98,43 25.27,40.71 v25.27,37.3 | RTL.4 37.35,51.13 v37.21,51.27
  Bottom 0.406: v37.21,51.27 37.21,51.02 35.43,51.02 34.67,50.25 31.36,50.25 29.59,48.48 28.57,48.48 28.06,47.97 27.05,47.97 26.54,47.46 26.54,46.44 26.03,45.94 26.03,38.06 v25.27,37.3
CAN_INT  (via drill 0.7)
  Top 0.406: IC4.12 14.78,37.2 v12.52,37.2 | IC2.8 18.87,43.8 | IC2.8 | v21.92,44.44 21.28,43.8 IC2.8
  Bottom 0.406: v12.52,37.2 20.39,37.2 22.8,39.61 22.8,43.55 v21.92,44.44
CS
  Top 0.406: 19.08,42.2 19.12,42.15 | 19.08,42.2 IC2.10 | IC4.16 19.02,42.25 19.08,42.2
D0  (via drill 0.7)
  Top 0.406: IC2.51 31.19,51.27 31.11,51.27 31.11,52.03 32.89,53.81 33.65,53.81 v34.16,54.32 | RTL.36 45.2,34.51 v44.32,34.51
  Bottom 0.406: v34.16,54.32 34.41,54.57 50.92,54.57 50.92,49.49 49.14,49.49 49.14,34.51 v44.32,34.51
D1  (via drill 0.7)
  Top 0.406: IC2.50 31.99,51.9 32.63,52.54 v33.4,52.54 | RTL.37 45.85,35.52 v45.33,35.52
  Bottom 0.406: v33.4,52.54 33.9,52.54 35.17,53.81 44.32,53.81 46.86,51.52 46.86,48.48 48.38,48.48 48.38,35.52 v45.33,35.52
D2  (via drill 0.7)
  Top 0.406: IC2.49 33.83,51.2 v33.9,51.27 | RTL.38 46.5,36.79 45.33,36.79 v45.08,37.05
  Bottom 0.406: v33.9,51.27 33.9,51.52 35.43,53.05 43.81,53.05 46.1,50.76 46.1,47.71 47.62,47.71 47.62,36.79 45.33,36.79 v45.08,37.05
D3  (via drill 0.7)
  Top 0.406: IC2.48 34.59,49.42 35.94,50.76 v35.94,52.03 | RTL.39 47.15,37.81 v46.35,37.81
  Bottom 0.406: v35.94,52.03 36.19,52.29 43.3,52.29 45.33,50.25 45.33,46.95 46.86,46.95 46.86,38.32 v46.35,37.81
D4  (via drill 0.7)
  Top 0.406: IC2.47 31.24,48.6 v30.86,48.22 | RTL.40 47.8,30.37 v47.11,29.68
  Bottom 0.406: v30.86,48.22 30.86,47.71 28.32,45.17 28.32,39.59 29.84,38.06 33.14,38.06 38.73,32.47 47.11,32.47 v47.11,29.68
D5  (via drill 0.7)
  Top 0.406: v45.84,28.66 47.62,28.66 48.45,29.5 RTL.41 | IC2.46 33.22,47.8 32.63,47.21 29.33,47.21 v29.08,47.46
  Bottom 0.406: v29.08,47.46 29.08,46.95 27.55,45.43 27.55,39.33 29.59,37.3 32.89,37.3 38.73,31.46 45.84,31.46 v45.84,28.66
D6  (via drill 0.7)
  Top 0.406: v46.86,27.65 47.62,27.65 49.1,29.13 RTL.42 | IC2.45 33.44,47 32.89,46.44 28.06,46.44 v27.55,46.95
  Bottom 0.406: v46.86,27.65 44.83,27.65 44.83,30.44 38.73,30.44 32.63,36.54 29.33,36.54 26.79,39.08 26.79,45.68 27.55,46.44 v27.55,46.95
D7  (via drill 0.7)
  Top 0.406: IC2.44 35.68,46.2 v36.19,45.68 | RTL.43 49.75,33.64 48.89,34.51 48.89,43.9 v44.57,43.9
  Bottom 0.406: v36.19,45.68 36.7,45.17 42.29,45.17 42.29,43.9 v44.57,43.9
GND  (via drill 0.7)
  Top 0.254: 45.84,55.59 45.33,55.59 RTL.95 | RTL.90 48.38,55.59 47.87,55.59 RTL.91 47.75,56.6 47.75,57.87 | 47.8,54.57 47.11,54.57 RTL.92 47.11,55.59 46.6,55.59 RTL.93 46.35,55.59 45.84,55.59 | 45.84,55.59 RTL.94 | RTL.28 39.24,35.52 39.24,36.03 RTL.27 39.24,36.28 | 39.24,37.55 RTL.25 | 39.24,36.79 RTL.26 | 50.41,55.59 49.91,55.59 RTL.88 | 50.41,55.59 50.92,55.59 RTL.86 51.05,56.6 51.05,57.87 | 50.41,55.59 RTL.87 | 57.02,35.52 57.02,35.01 RTL.52 | 39.24,39.33 RTL.22 39.24,39.59 | IC2.59 24.76,51.27 24.25,51.27 IC2.60 23.74,51.27 23.24,51.27 IC2.61 | 45.08,57.87 45.33,57.87 | RTL.56 56,37.55 55.49,37.05 v55.24,36.54 55.75,36.28 56,36.28 RTL.54 57.02,36.03 57.02,35.52 | RTL.18 39.24,41.87 39.24,41.36 RTL.19 | 39.24,40.09 RTL.21 | 57.02,35.52 RTL.53 | 39.24,38.06 RTL.24 | 39.24,38.82 RTL.23
  Top 0.406: IC2.53 29.59,53.3 29.08,53.81 29.08,54.06 28.82,54.32 | 28.82,54.32 C5.1 | C7.1 24.59,54.23 24.79,54.03 IC2.59 | RTL.91 47.8,54.57 47.8,52.98 v47.62,52.79 | v42.29,46.7 arc-90 42.16,46.58 RTL.11 39.16,46.01 39.24,45.94 39.23,45.93 RTL.12 | v42.03,40.6 41.91,40.73 | v50.67,34.51 50.4,34.51 RTL.44 50.4,31.7 50.41,31.71 50.41,29.43 47.37,26.38 47.37,22.99 | RTL.55 55.24,36.83 v55.24,36.54 | RTL.64 54.22,42.68 v54.22,43.65 | 39.16,45.5 39.24,45.43 39.16,45.35 RTL.13 39.16,44.74 39.24,44.67 39.2,44.63 RTL.14 | 58.8,18.25 58.8,20.79 C4.2 58.71,19.01 v56.76,19.01 | 58.8,18.25 C3.1 | 58.8,18.25 58.8,15.71 | C14.2 58.8,13.17 58.8,15.71 | 58.8,15.71 C2.1 | R13.1 47.37,22.99 | 47.37,22.99 48.98,22.99 v49.91,22.06 | RTL.83 53,57.87 v52.95,57.87 | IC2.61 23.24,51.2 23.24,50 21.59,50 IC2.63 | 24.76,35.6 IC2.22 24.79,33.78 23.24,32.22 21.71,32.22 20.95,31.46 v20.95,30.19 | C6.1 20.95,26.38 v21.2,26.63 | IC5.8 25.01,14.19 25.01,1.49 | IC6.15 14.42,64.25 15.18,65.01 | 15.18,65.01 15.18,71.74 13.28,71.74 13.3,71.72 C23.2 11.67,71.7 11.63,71.74 11.54,71.65 C20.2 9.69,71.65 9.6,71.74 C19.2 | 24.76,54.32 24.76,55.05 24.46,55.36 24.46,57.77 25.22,58.53 25.24,58.51 R7.1 25.72,58.78 25.73,58.79 25.73,59.68 25.98,59.93 28.9,59.93 29.92,58.92 32.58,58.92 | 28.82,54.32 28.82,55.16 32.58,58.92 | 34.21,58.89 34.13,58.89 34.11,58.92 32.96,58.92 | 32.58,58.92 32.96,58.92 | 32.96,58.92 32.05,58.89 COM1.3 32.08,63.74 | COM1.G2 45.59,64.81 45.33,64.55 | 15.18,65.01 15.18,68.57 16.45,69.84 29.79,69.84 32.08,67.68 32.08,63.74 | 32.08,63.74 32.96,64.63 33.85,64.63 34.36,65.14 35.25,65.14 36.16,66.05 COM1.9
  Top 0.406: 59.63,1.49 59.63,1.64 59.71,1.69
  Top 0.813: 41.91,40.73 39.24,40.73 | 39.24,40.73 RTL.20 | RTL.12 39.16,45.5 | CAN.1 16.21,1.49 16.12,1.49 | 3.17,1.46 16.12,1.49 | 16.12,1.49 25.01,1.49 38.48,1.49 | 38.48,1.49 55.24,1.49 | 55.24,1.49 59.63,1.49 69.72,1.49 | ETH.G1 38.48,6.06 38.48,1.49 | 55.24,1.49 ETH.G2 | ISP.4 ISP.6 ISP.8 ISP.10 | v55.24,36.54 53.97,36.54 53.97,39.84 51.94,41.87 51.94,43.65 52.19,43.65 | 52.19,43.65 v54.22,43.65 | v45.84,45.43 50.16,45.43 50.16,43.65 52.19,43.65 | C7.1 24.76,54.32 | 39.24,36.28 39.24,36.79 39.24,37.55 39.24,38.06 39.24,38.82 39.24,39.33 | 39.24,40.73 39.24,40.09 39.24,39.59 | 39.24,40.73 39.24,41.36 | 34.21,58.89 34.49,59.04 36.14,59.04 37.31,57.87 45.08,57.87 | 55.6,61.18 55.7,61.07 55.75,61.13 C11.- 54.73,61.18 52.95,59.4 v52.95,57.87 51.05,57.87 47.75,57.87 45.33,57.87 44.65,57.87 44.65,64.88 COM1.G2
  Bottom 0.406: 27.05,27.65 C8.1 | 27.05,27.65 C9.1 | C17.1 55.67,22.39 55.49,22.57 55.29,22.36 54.99,22.36 | 54.99,22.36 C18.1 | C24.2 47.62,51.02 v47.62,52.79 | C16.2 43.91,46.7 43.81,46.7 | 42.2,40.77 v42.03,40.6 | v55.24,36.54 55.24,36.7 C26.2 53.51,33.49 50.67,33.49 v50.67,34.51 C25.1 | v54.22,43.65 54.22,43.82 | 9.19,28.38 C29.2 C28.2 | 43.91,40.86 C15.1 | v49.91,22.06 50.92,21.04 54.99,21.04 | 54.99,21.04 54.99,22.36 | v56.76,19.01 54.99,20.79 54.99,21.04 | 24,26.63 v21.2,26.63 | 27.05,26.63 24,26.63 | 27.05,26.63 27.05,27.65 | v20.95,30.19 20.95,29.68 24,26.63 | IC5.8 27.55,16.73 27.55,26.63 27.05,26.63 | COM1.G1 22.32,62.09 30.68,62.09 31.95,63.36 31.95,63.51 COM1.3
  Bottom 0.813: v42.29,46.7 43.81,46.7 43.81,45.43 v45.84,45.43 45.84,40.86 43.91,40.86 | C15.1 42.2,40.77 | 54.22,43.82 C27.1 | IC3.GND 62.1,51.27 C13.2 C12.2 62.1,50 60.57,50 60.57,43.65 60.32,43.65 | ETH.G1 38.48,6.06 | v54.22,43.65 60.32,43.65 | 60.32,43.65 70.23,43.65 70.23,32.47 67.69,32.47 67.69,4.53 69.72,4.53 | v52.95,57.87 57.53,57.87 60.57,54.83 60.57,50.25 | IC5.2 22.73,23.56 21.15,25.13 21.15,26.58 v21.2,26.63 | X2.2 56.82,72.61 52.01,67.81 51.99,67.83 C10.- 47.72,67.83 44.78,64.88 COM1.G2
  other vias: 59.56,44.67 52.95,48.98 44.83,38.82 40.25,19.27 33.9,29.6 29.08,33.49 50.16,25.11 59.56,25.36 59.56,29.17 52.45,40.35 61.29,7.84 23.41,59.45
  pour Top (isolate 0.254): 73.96,77.13 0.22,77.2 0.33,0.32 74.06,0.42
  pour Bottom (isolate 0.254): 0.17,77.18 73.93,77.18 73.88,0.24 0.2,0.22
MISO  (via drill 0.7)
  Top 0.406: IC2.13 20.46,39.8 v21.03,39.23 | IC4.15 13.18,40.98 v12.77,41.39
  Bottom 0.406: v21.03,39.23 22.04,40.25 22.04,42.15 21.79,42.41 13.79,42.41 v12.77,41.39
MOSI  (via drill 0.7)
  Top 0.406: IC2.12 20.36,40.6 v21.03,41.26 | IC4.14 12.87,39.71 v12.64,39.48
  Bottom 0.406: v12.64,39.48 14.42,41.26 v21.03,41.26
N$1
  Top 0.305: RTL.58 58.34,38.78 58.8,38.32 58.8,33.24 59.56,32.47 69.72,32.47 70.99,31.2 U$2.6
  Bottom 0.406: R1.2 68.96,20.19 68.96,29.68 U$2.6 71.24,29.68
N$2
  Top 0.406: IC5.1 25.27,22.67 23.69,24.24 16.84,24.24 14.3,26.78 2.61,26.78 2.61,44.79 IC4.1
N$3
  Top 0.305: RTL.59 58.45,39.43 59.3,38.57 59.3,33.49 59.81,32.98 71.5,32.98 72.77,31.71 72.77,25.62 71.75,24.6 U$2.4
  Bottom 0.406: R1.1 U$2.4
N$4  (via drill 0.7)
  Top 0.406: U$2.3 72.77,15.2 72.77,11.14 71.5,9.87 63.11,9.87 62.61,9.36 59.56,9.36 58.71,10.21 C1.1 56,10.63 56,13.68 v48.64,13.68 | RTL.46 51.7,29.68 v52.95,29.68
  Bottom 0.406: v52.95,29.68 50.41,29.68 47.37,26.63 47.37,19.01 48.64,17.74 v48.64,13.68
N$5
  Top 0.406: C7.2 22.89,54.23 22.39,53.73 IC2.62
N$6
  Top 0.406: Q1.1 29.59,30.19 26.39,33.38 IC2.24
  Bottom 0.406: Q1.1 29.59,30.19 29.67,30.1 C9.2
N$7
  Top 0.406: Q1.2 24.76,30.19 25.59,31.02 IC2.23
  Bottom 0.406: Q1.2 24.63,30.06 24.76,29.93 24.67,29.85 C8.2
N$8
  Bottom 0.813: C12.1 62.19,48.39 62.35,48.22 62.86,48.73 IC3.IN 72.51,48.73 72.51,56.35 63.37,56.35 55.47,64.25 51.89,64.25 51.91,64.27 C10.+ 51.79,64.27 50.24,62.73 D1.C
N$9
  Top 0.406: R7.2 27.62,58.42 27.77,58.27 POWER.C
N$10
  Bottom 0.813: D1.A 41.09,60.92 41.09,68.06 48.71,75.68 62.68,75.68 62.81,75.55 62.81,72.63 X2.1
N$11  (via drill 0.7)
  Top 0.406: C1.2 v61.84,10.63 69.72,10.63 U$2.1 | RTL.45 51.05,28.66 v51.68,28.66
  Bottom 0.406: v51.68,28.66 50.41,28.66 48.13,26.38 48.13,22.06 49.91,20.28 49.91,19.01 51.43,17.49 51.43,14.44 56,14.44 56,10.63 v61.84,10.63
N$12
  Top 0.406: C3.2 66.92,18.25 68.19,19.52 68.19,25.62 69.46,26.89 70.73,26.89 U$2.5
N$13
  Top 0.406: C2.2 69.72,15.71 U$2.2
N$14
  Top 0.406: U$2.11 63.37,14.19 62.35,13.17 C14.1
N$15
  Top 0.406: C4.1 63.88,20.79 65.4,22.31 65.4,26.12 64.38,27.14 U$2.8
N$16
  Top 0.813: CAN.4 32.71,15.53 F2.P$1
N$17
  Top 0.406: IC6.1 4.14,65.52 C21.2
N$18
  Top 0.406: U$2.12 56.76,11.9 56.76,14.95 42.29,14.95 42.29,16.98 ETH.1-1
N$19  (via drill 0.7)
  Top 0.406: v56.76,16.98 56.76,15.71 43.81,15.71 43.81,19.52 ETH.1-2
  Bottom 0.406: v56.76,16.98 U$2.10
N$20
  Top 0.406: U$2.9 60.83,22.06 58.03,22.06 54.22,18.25 46.1,18.25 44.83,16.98 ETH.1-3
N$21
  Top 0.406: 1.47,41.39 1.49,27.72 1.49,25.82 13.86,25.82 17.6,22.09 | 1.47,41.39 1.47,41.52 | 17.6,22.09 17.6,22.06 IC5.4 17.62,22.06 17.6,22.09 | 17.6,22.09 17.6,22.21 | IC4.2 7.18,43.52 7.18,45.96 1.47,45.96 1.47,41.39
N$22
  Top 0.406: R6.1 3.98,52.97 4.01,52.95 3.98,52.92 ISP.9
N$23
  Top 0.406: CAN.3 23.21,8.32 21.46,6.57 19.43,6.57 18.16,7.84 18.16,12.41 IC5.6 20.19,14.52 20.16,14.54 20.16,15.13 17.99,17.3 R20.1
N$24
  Top 0.406: U$2.7 61.34,27.65 61.34,23.58 60.57,22.82 57.78,22.82 55.49,20.79 50.16,20.79 48.89,19.52 ETH.1-6
N$25
  Top 0.406: R5.1 11.64,53.22 11.63,53.2 14.14,50.69 ISP.1
N$26  (via drill 0.7)
  Top 0.406: v15.87,30.44 15.87,28.92 R3.1 | IC2.1 19.78,49.4 20.7,48.48 v20.7,47.21
  Bottom 0.406: v20.7,47.21 23.57,44.34 23.57,39.1 20.65,36.31 15.87,36.31 v15.87,30.44
N$27  (via drill 0.7)
  Top 0.406: v4.69,20.33 CAN1.A | IC4.11 16.3,35.9 v17.06,35.14
  Bottom 0.406: v17.06,35.14 17.06,29.25 10.08,22.26 6.62,22.26 v4.69,20.33
N$28
  Top 0.406: ACT.A 60.11,3.52 R17.2
N$29
  Top 0.406: R4.1 6.56,53.6 6.52,53.56 ISP.7
N$30
  Top 0.406: IC6.4 4.14,61.71 C22.2
N$31
  Top 0.406: R16.2 64.46,3.44 62.34,3.44 LINK.A
N$32
  Top 0.406: IC2.58 25.59,52.18 25.73,52.31 25.73,56.38 25.67,56.43 POWER.A
N$33
  Top 0.406: 17.72,53.61 R5.2 | 17.72,53.61 18.51,53.61 JP1.2 | IC2.2 17.72,48.6 17.72,53.61
N$34
  Top 0.406: 57.35,25.18 57.15,24.98 Q2.2 57.02,25.11 55.24,28.41 55.24,32.98 56.48,34.23 RTL.51
  Bottom 0.406: Q2.2 57.15,24.98 57.41,24.72 C17.2
N$35
  Top 0.406: Q2.1 52.45,25.11 54.3,28.49 RTL.50
  Bottom 0.406: Q2.1 52.32,24.98 52.19,24.85 52.38,24.66 C18.2
N$36
  Top 0.406: IC6.5 5.79,60.44 5.02,59.68 4.26,59.68 4.25,59.69 C22.1
N$37
  Top 0.406: IC6.3 4.14,62.98 C21.1
N$38  (via drill 0.7)
  Top 0.406: v11.25,20.31 CAN2.A | v18.74,34.2 18.31,33.77 16.78,33.77 15.95,34.61 14.83,34.61 IC4.10
  Bottom 0.406: v11.25,20.31 11.25,22.14 18.03,28.92 18.03,33.49 v18.74,34.2
N$39
  Top 0.406: 45.84,24.6 R13.2 45.84,25.87 43.9,27.81 RTL.34
N$40
  Top 0.406: IC6.14 14.93,62.98 16.07,64.25 16.07,67.55 17.47,68.82 28.27,68.82 30.68,66.41 COM1.7
N$41  (via drill 0.7)
  Top 0.406: IC6.8 v10.1,56.63
  Bottom 0.406: v10.1,56.63 10.74,56.63 15.31,61.2 37.28,61.2 38.93,62.73 38.93,68.82 35.89,68.82 33.55,66.48 33.55,66.36 COM1.8
N$43
  Top 0.406: IC6.2 8.71,64.25 9.6,65.14 C19.1
N$44  (via drill 0.7)
  Top 0.406: R6.2 JP1.4 | IC2.3 17.29,47.8 16.84,48.25 16.84,52.18 v16.58,52.44
  Bottom 0.406: JP1.4 17.34,55.11 16.58,54.34 v16.58,52.44
N$45  (via drill 0.7)
  Top 0.406: RTL.61 54.86,40.73 v53.21,42.38 | R16.1 v64.46,7.23
  Bottom 0.406: v53.21,42.38 62.86,42.38 62.86,35.27 66.42,31.71 66.42,9.84 64.46,7.89 v64.46,7.23
N$46
  Top 0.406: IC6.6 9.09,59.17 10.61,60.69 10.61,68.44 11.5,69.33 C20.1
N$47  (via drill 0.7)
  Top 0.406: RTL.62 v59.04,41.38 v59.05,41.36 | R17.1 v58.09,7.18
  Bottom 0.406: v59.05,41.36 62.1,41.36 62.1,35.01 65.65,31.46 65.65,10.35 64.82,9.51 59.76,9.51 58.06,7.81 58.06,7.2 v58.09,7.18
N$48
  Top 0.406: R15.1 6.84,24.08 6.74,24.18 CAN1.C
N$49  (via drill 0.7)
  Top 0.406: IC6.7 9.6,57.9 v10.1,58.41
  Bottom 0.406: COM1.1 22.63,68.69 17.22,68.69 10.1,61.58 v10.1,58.41
N$50
  Top 0.406: IC6.13 17.47,61.71 17.98,61.2 27,61.2 29.43,63.64 COM1.2
N$52
  Top 0.406: CAN2.C 11.25,24.07 11.22,24.04 11.19,24.08 R18.1
N$53
  Top 0.406: 11.6,30.32 11.63,30.34 | Q3.1 11.6,30.32 | 11.6,30.32 9.6,32.32 9.6,35.17 7.95,36.82 | 7.95,36.82 7.69,37.07 | IC4.7 7.59,37.17 7.95,36.82
  Bottom 0.406: C28.1 11.82,28.22 | C28.1 11.98,28.38 11.86,28.26 | Q3.1 11.6,30.24 11.82,30.02 C28.1
N$54
  Top 0.406: Q3.2 8.71,32.22 8.71,34.79 7.56,35.93 5.02,35.93 IC4.8
  Bottom 0.406: Q3.2 6.75,30.29 6.56,30.1 C29.1
N$59
  Top 0.406: CAN.2 19.68,9.56 19.68,11.39 IC5.7 22.73,14.52 22.78,14.57 22.75,14.59 22.75,15.02 21.41,16.37 20.21,16.37 18.54,18.05 17.17,18.05 16.01,19.2 R20.2
RST
  Top 0.406: 17.65,26.38 C6.2 16.99,26.38 14.8,28.56 14.8,31.36 14.85,31.41 14.85,31.46 | 14.85,31.46 R2.1 17.6,31.46 17.6,32.88 19.63,32.88 20.65,33.9 22.93,33.9 23.19,34.16 IC2.20 | ISP.5 10.28,49.39 15.06,49.39 15.82,48.63 15.82,47.87 16.71,46.98 16.71,44.06 16.2,43.55 14.93,43.55 14.91,43.52 IC4.17 13,43.52 9.22,39.74 9.22,37.07 14.83,31.46 14.85,31.46
RXD
  Top 0.406: JP1.1 20.01,57.77 17.34,60.44 IC6.12
RXD1  (via drill 0.7)
  Top 0.406: IC2.27 28.79,39.62 28.32,40.09 28.32,42.89 25.27,45.94 v25.27,47.21 | v15.31,56.63 IC6.9
  Bottom 0.406: v25.27,47.21 27.17,49.24 27.81,49.24 28.32,49.75 28.32,53.4 25.34,56.38 15.57,56.38 v15.31,56.63
SCK  (via drill 0.7)
  Top 0.406: IC2.11 16.58,41.4 16.58,38.44 IC4.13 14.78,38.47 10.87,38.47 v10.74,38.6 | R4.2 9.95,53.61 v10.1,53.58
  Bottom 0.406: v10.1,53.58 13.79,53.58 16.96,50.41 16.96,48.37 11.37,42.79 11.37,39.23 v10.74,38.6
TXD
  Top 0.406: IC6.10 17.22,57.9 JP1.3
TXD1  (via drill 0.7)
  Top 0.406: IC2.28 29.59,40.09 29.08,40.6 29.08,43.4 26.54,45.94 26.54,47.46 27.05,47.97 28.06,47.97 28.57,48.48 29.59,48.48 30.37,49.26 31.57,49.26 32.25,50 33.65,50 33.9,50.25 34.41,50.25 34.92,50.76 34.92,53.3 35.17,53.56 v35.17,57.37 | IC6.11 15.57,59.17 v15.69,59.3
  Bottom 0.406: v15.69,59.3 16.2,59.8 20.01,59.8 22.42,57.39 35.2,57.39 | 35.2,57.39 35.25,57.39 | v35.17,57.37 35.2,57.39
VCC  (via drill 0.7)
  Top 0.254: RTL.65 56,43.4 55.49,43.4 55.49,46.58 | 42.29,32.73 42.03,32.73 RTL.31 | RTL.32 42.54,31.71 42.29,31.71
  Top 0.406: 19.68,31.46 21.2,32.98 22.98,32.98 23.99,33.99 IC2.21 24,35.52 | RTL.89 49.1,52.84 v49.14,52.79 49.14,51.52 | RTL.6 42.21,49.83 v42.29,49.75 43.56,49.75 43.56,51.52 | RTL.47 52.35,34.51 v52.19,34.51 | RTL.57 55.24,38.13 v55.24,38.32 | RTL.70 55.49,46.58 54.22,46.58 54.22,46.95 | 54.22,46.95 v54.22,45.68 | 39.24,43.25 39.24,43.14 | RTL.15 39.24,43.9 39.24,43.25 | 39.24,43.25 RTL.16 | 39.24,43.25 39.24,42.75 RTL.17 39.16,42.63 v42.03,42.63 43.3,42.63 | v32.13,55.84 32.13,55.75 C5.2 30.69,54.23 30.86,54.06 30.39,53.6 IC2.52 30.39,50.5 29.15,49.26 21.15,49.26 20.79,49.62 IC2.64 20.79,51.52 20.7,51.52 | 43.56,46.95 54.22,46.95 | 42.54,31.71 42.57,31.69 RTL.32 | 19.68,31.46 R2.2 | 19.68,28.92 19.68,31.46 | 19.68,28.41 19.68,28.75 R3.2 19.68,28.92 | 22.73,26.28 22.73,26.89 20.7,28.92 19.68,28.92 | IC4.6 5.02,38.47 5.02,39.74 | 5.02,39.74 IC4.5 | 5.02,39.74 5.02,40.96 IC4.4 7.03,40.98 v8.96,42.91 10.49,44.44 | 10.49,44.44 10.61,44.56 | 10.49,44.44 10.84,44.79 IC4.18 14.8,47.36 14.14,48.02 ISP.2 | IC6.16 13.2,65.6 13.79,66.18 v13.79,67.93 13.47,68.25 13.47,69.84 C23.1 | 33.85,26.28 F2.P$2 | R18.2 9,22.18 8.99,22.16 8.97,22.18 R15.2 7.95,22.18 v7.95,19.06
  Top 0.813: C11.+ 55.75,54.32 52.95,51.52 49.14,51.52 43.56,51.52 43.56,46.95 43.56,45.68 43.3,45.68 43.3,42.63 43.3,39.33 42.29,39.33 42.29,32.73 42.29,31.71 | RTL.31 36.54,26.28 33.85,26.28 27.5,26.28 | 27.5,26.28 22.73,26.28 | IC5.3 v20.19,19.67 27.5,19.67 27.5,26.28
  Bottom 0.254: C25.2 50.92,38.82 50.92,45.17 51.94,45.17 C27.2
  Bottom 0.406: v49.14,52.79 49.65,52.29 49.65,51.27 49.49,51.1 C24.1 | C16.1 43.91,49.75 v42.29,49.75 | C15.2 43.75,42.63 v42.03,42.63 | v55.24,38.32 55.24,38.4 C26.1 53.51,38.57 52.19,38.57 | C27.2 54.22,45.52 v54.22,45.68 | 52.19,38.57 v52.19,34.51 | C25.2 50.67,38.57 52.19,38.57 | v13.79,67.93 16.33,70.47 39.82,70.47 39.82,61.96 37.79,59.93 37.79,55.84 | v7.95,19.06 7.08,19.06 7.08,18.99
  Bottom 0.813: 62.1,53.81 61.84,53.81 | 62.1,53.81 62.35,53.81 | 62.1,53.81 IC3.OUT | 62.1,53.81 C13.1 | 62.1,53.81 62.1,55.59 58.54,59.14 C11.+ 52.19,59.14 49.65,55.84 37.79,55.84 v32.13,55.84 32.25,55.84 | v8.96,42.91 7.95,43.93 2.61,43.93 2.61,18.99 7.08,18.99 19.48,18.99 20.19,19.7 v20.19,19.67 20.21,19.7